# EAGLE design STorM32 RPiHat Extension v030 (EAGLE 7.5.0)
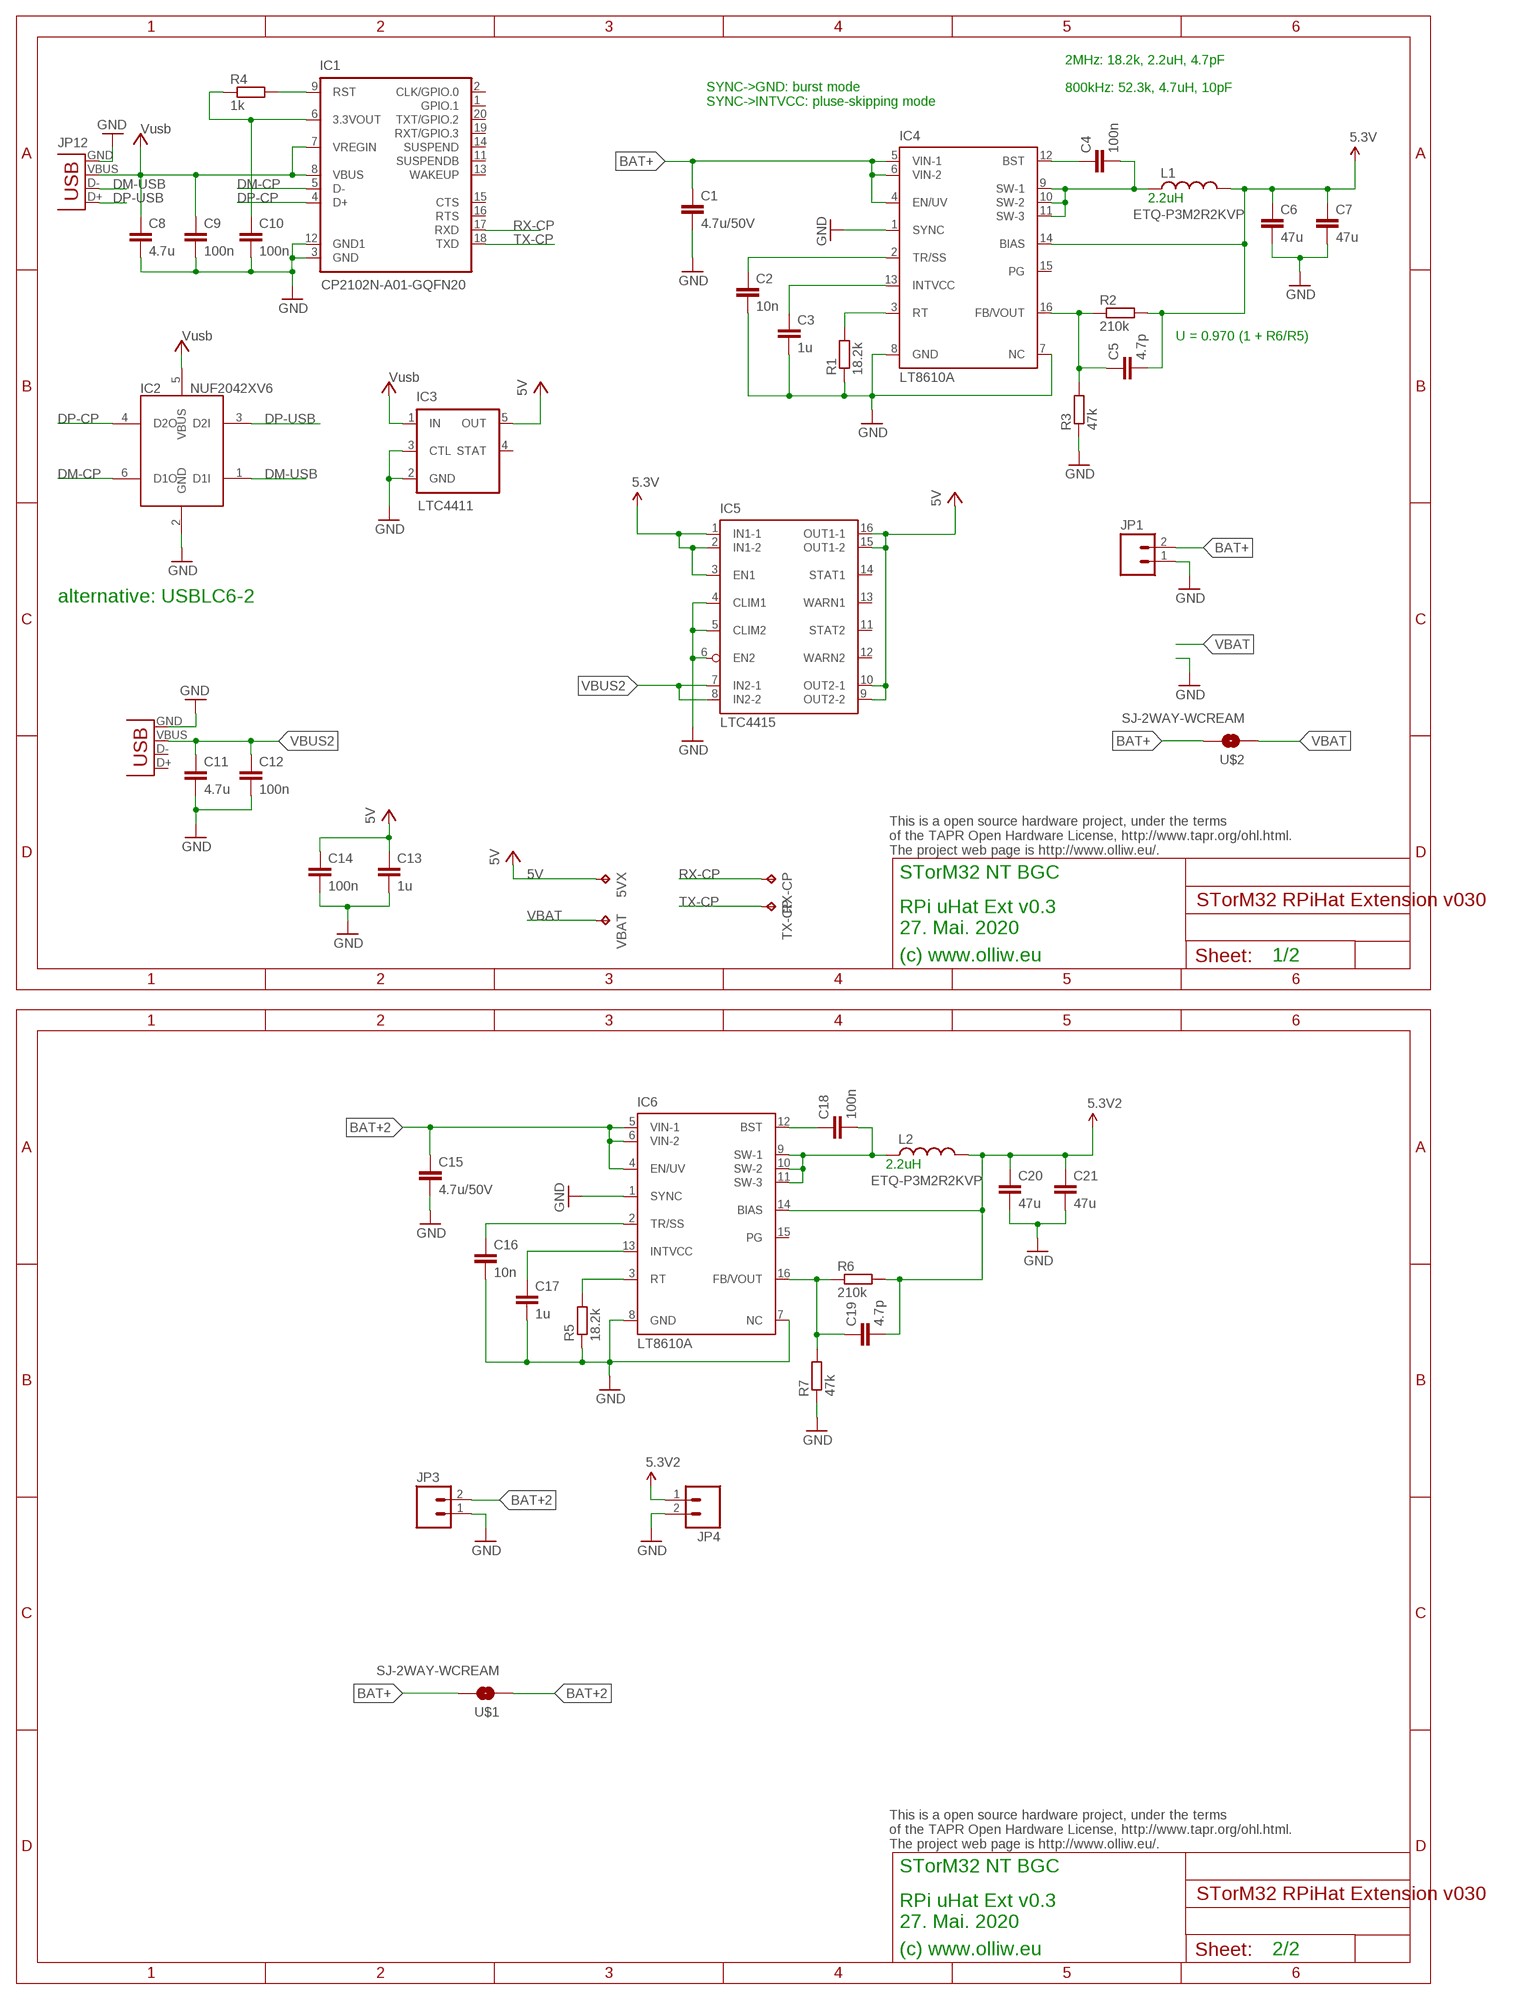
[diagram p0: schematic, sheet 1]

## Parts
5VX  TPB1,27  [B1,27]
C1  4.7u/50V  C-EUC1206  [C1206]
C2  10n  C-EUC0603K  [C0603K]
C3  1u  C-EUC0603K  [C0603K]
C4  100n  C-EUC0603K  [C0603K]
C5  4.7p  C-EUC0603K  [C0603K]
C6  47u  C-EUC1210  [C1210]
C7  47u  C-EUC1210  [C1210]
C8  4.7u  C-EUC0603  [C0603]
C9  100n  C-EUC0402  [C0402]
C10  100n  C-EUC0402  [C0402]
C11  4.7u  C-EUC0603  [C0603]
C12  100n  C-EUC0402  [C0402]
C13  1u  C-EUC0603  [C0603]
C14  100n  C-EUC0402  [C0402]
C15  4.7u/50V  C-EUC1206  [C1206]
C16  10n  C-EUC0603K  [C0603K]
C17  1u  C-EUC0603K  [C0603K]
C18  100n  C-EUC0603K  [C0603K]
C19  4.7p  C-EUC0603K  [C0603K]
C20  47u  C-EUC1210  [C1210]
C21  47u  C-EUC1210  [C1210]
IC1  CP2102N-A01-GQFN20  CP2102N-QFN20  [QFN20-CP2102N]
IC2  NUF2042XV6  [SOT563-6]
IC3  LTC4411  LTC411SOT23-5-SPARKFUN  [SOT23-5-SPARKFUN]
IC4  LT8610A  LT8610  [MSOP16]
IC5  LTC4415  [LTC4415]
IC6  LT8610A  LT8610  [MSOP16]
JP1  M021X02_NO_SILK  [1X02_NO_SILK]
JP3  M021X02_NO_SILK  [1X02_NO_SILK]
JP4  M021X02_NO_SILK  [1X02_NO_SILK]
L1  ETQ-P3M2R2KVP  LL5.4X5.4  [L5.4X5.4]
L2  ETQ-P3M2R2KVP  LL5.4X5.4  [L5.4X5.4]
R1  18.2k  R-EU_R0603  [R0603]
R2  210k  R-EU_R0603  [R0603]
R3  47k  R-EU_R0603  [R0603]
R4  1k  R-EU_R0402  [R0402]
R5  18.2k  R-EU_R0603  [R0603]
R6  210k  R-EU_R0603  [R0603]
R7  47k  R-EU_R0603  [R0603]
RX-CP  TPB1,27  [B1,27]
TX-CP  TPB1,27  [B1,27]
U$1  SJ-2WAY-WCREAM  [SJ-2WAY-BIG-WCREAM]
U$2  SJ-2WAY-WCREAM  [SJ-2WAY-BIG-WCREAM]
USB  Amphenol 10118192-0001LF  USB-MICROB  [USB-MICROB]
USB1  Amphenol 10118192-0001LF  USB-MICROB  [USB-MICROB]
VBAT  TPB1,27  [B1,27]

## Nets
3.3V-CP2102: C10.1 IC1.6(3.3VOUT) R4.1
5.3V: C5.2 C6.1 C7.1 IC4.14(BIAS) IC5.1(IN1-1) IC5.2(IN1-2) IC5.3(EN1) L1.2 R2.2
5.3V2: C19.2 C20.1 C21.1 IC6.14(BIAS) JP4.1 L2.2 R6.2
5V: 5VX.TP C13.1 C14.1 IC3.5(OUT) IC5.9(OUT2-2) IC5.10(OUT2-1) IC5.15(OUT1-2) IC5.16(OUT1-1)
BAT+: C1.1 IC4.4(EN/UV) IC4.5(VIN-1) IC4.6(VIN-2) JP1.2 U$1.2 U$2.2
BAT+2: C15.1 IC6.4(EN/UV) IC6.5(VIN-1) IC6.6(VIN-2) JP3.2 U$1.1
DM-CP: IC1.5(D-) IC2.6(D1O)
DM-USB: IC2.1(D1I) USB.D-
DP-CP: IC1.4(D+) IC2.4(D2O)
DP-USB: IC2.3(D2I) USB.D+
GND: C1.2 C2.2 C3.2 C6.2 C7.2 C8.2 C9.2 C10.2 C11.2 C12.2 C13.2 C14.2 C15.2 C16.2 C17.2 C20.2 C21.2 IC1.3(GND) IC1.12(GND1) IC2.2(GND) IC3.2(GND) IC3.3(CTL) IC4.1(SYNC) IC4.7(NC) IC4.8(GND) IC5.4(CLIM1) IC5.5(CLIM2) IC5.6(EN2) IC6.1(SYNC) IC6.7(NC) IC6.8(GND) JP1.1 JP3.1 JP4.2 R1.1 R3.1 R5.1 R7.1 USB1.GND USB.GND
N$3: C19.1 IC6.16(FB/VOUT) R6.1 R7.2
N$6: C17.1 IC6.13(INTVCC)
N$8: C4.1 IC4.12(BST)
N$9: C5.1 IC4.16(FB/VOUT) R2.1 R3.2
N$10: C18.1 IC6.12(BST)
N$11: IC4.3(RT) R1.2
N$12: C3.1 IC4.13(INTVCC)
N$16: IC6.3(RT) R5.2
N$17: C2.1 IC4.2(TR/SS)
N$18: IC1.9(RST) R4.2
N$19: C16.1 IC6.2(TR/SS)
RX-CP: IC1.17(RXD) RX-CP.TP
SW: C18.2 IC6.9(SW-1) IC6.10(SW-2) IC6.11(SW-3) L2.1
SW1: C4.2 IC4.9(SW-1) IC4.10(SW-2) IC4.11(SW-3) L1.1
TX-CP: IC1.18(TXD) TX-CP.TP
VBAT: U$2.1 VBAT.TP
VBUS2: C11.1 C12.1 IC5.7(IN2-1) IC5.8(IN2-2) USB1.VBUS
VUSB: C8.1 C9.1 IC1.7(VREGIN) IC1.8(VBUS) IC2.5(VBUS) IC3.1(IN) USB.VBUS ; supply symbol labelled Vusb
Unconnected: IC1.1(GPIO.1) IC1.2(CLK/GPIO.0) IC1.11(SUSPENDB) IC1.13(WAKEUP) IC1.14(SUSPEND) IC1.15(CTS) IC1.16(RTS) IC1.19(RXT/GPIO.3) IC1.20(TXT/GPIO.2) IC3.4(STAT) IC4.15(PG) IC5.11(STAT2) IC5.12(WARN2) IC5.13(WARN1) IC5.14(STAT1) IC6.15(PG) USB1.D+ USB1.D-

## Notes on the sheet
- 2MHz: 18.2k, 2.2uH, 4.7pF
- 800kHz: 52.3k, 4.7uH, 10pF
- SYNC->GND: burst mode
  SYNC->INTVCC: pluse-skipping mode
- JP12
- 2.2uH
- U = 0.970 (1 + R6/R5)
- alternative: USBLC6-2
- This is a open source hardware project, under the terms
  of the TAPR Open Hardware License, http://www.tapr.org/ohl.html.
  The project web page is http://www.olliw.eu/.
- STorM32 NT BGC
- RPi uHat Ext v0.3
  27. Mai. 2020
- (c) www.olliw.eu | 1/2
- 2.2uH
- This is a open source hardware project, under the terms
  of the TAPR Open Hardware License, http://www.tapr.org/ohl.html.
  The project web page is http://www.olliw.eu/.
- STorM32 NT BGC
- RPi uHat Ext v0.3
  27. Mai. 2020
- (c) www.olliw.eu | 2/2

## Library data of the parts
5VX RX-CP TX-CP VBAT = testpad:TP: Test pad
C1-C21 = rcl:C-EU: CAPACITOR, European symbol
IC1 = # stdlib:CP2102N-QFN20
IC2 = #z pixhawk2:NUF2042XV6
IC3 = # stdlib:LTC411
IC4 IC6 = # stdlib:LT8610
IC5 = # stdlib:LTC4415
JP1 JP3 JP4 = # SparkFun2:M02: Header 2 Standard 2-pin 0.1" header. Use with straight break away headers (SKU : PRT-00116), right angle break away headers (PRT-00553), swiss pins (PRT-00743), machine pins (PRT-00117), and female headers (PRT-00115). Molex polarized connector foot print use with SKU : PRT-08233 with associated crimp pins and housings.
L1 L2 = # stdlib:L
R1-R7 = rcl:R-EU_: RESISTOR, European symbol
U$1 U$2 = # stdlib:SJ-2WAY
USB USB1 = # SparkFun2:USB: USB Connectors USB-B-PTH is fully proven SKU : PRT-00139 USB-miniB is fully proven SKU : PRT-00587 USB-A-PCB is untested. USB-A-H is throughly reviewed, but untested. Spark Fun Electronics SKU : PRT-00437 USB-B-SMT is throughly reviewed, but untested. Needs silkscreen touching up. USB-A-S has not been used/tested USB-MB-H has not been used/tested

## Board
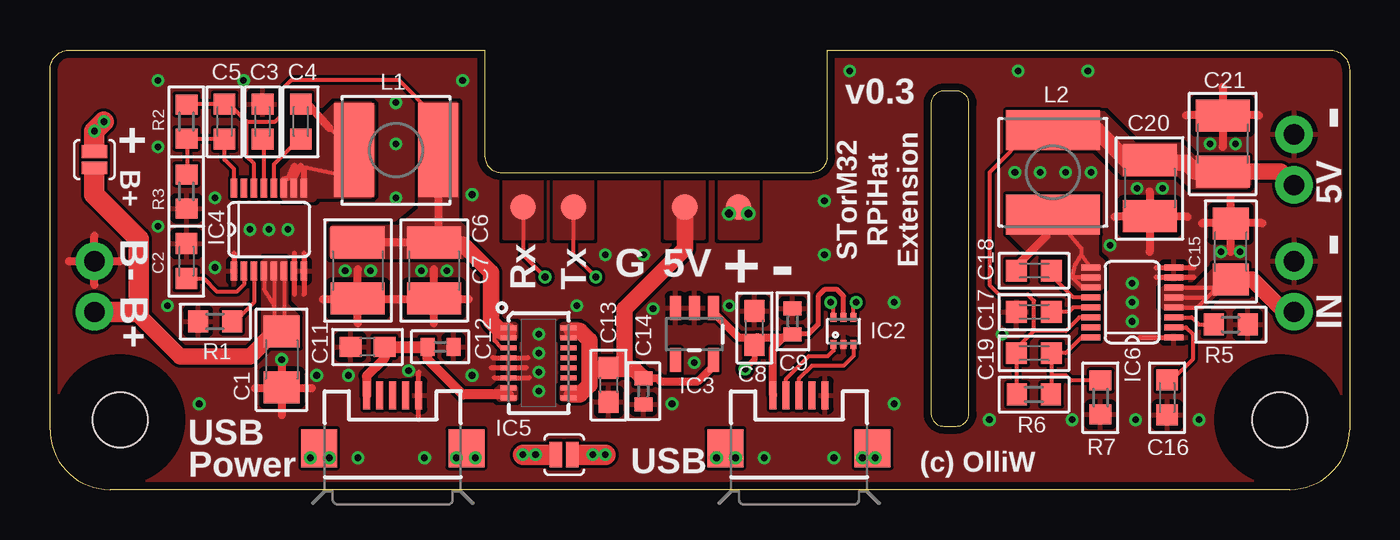
[diagram p1: board, top side]
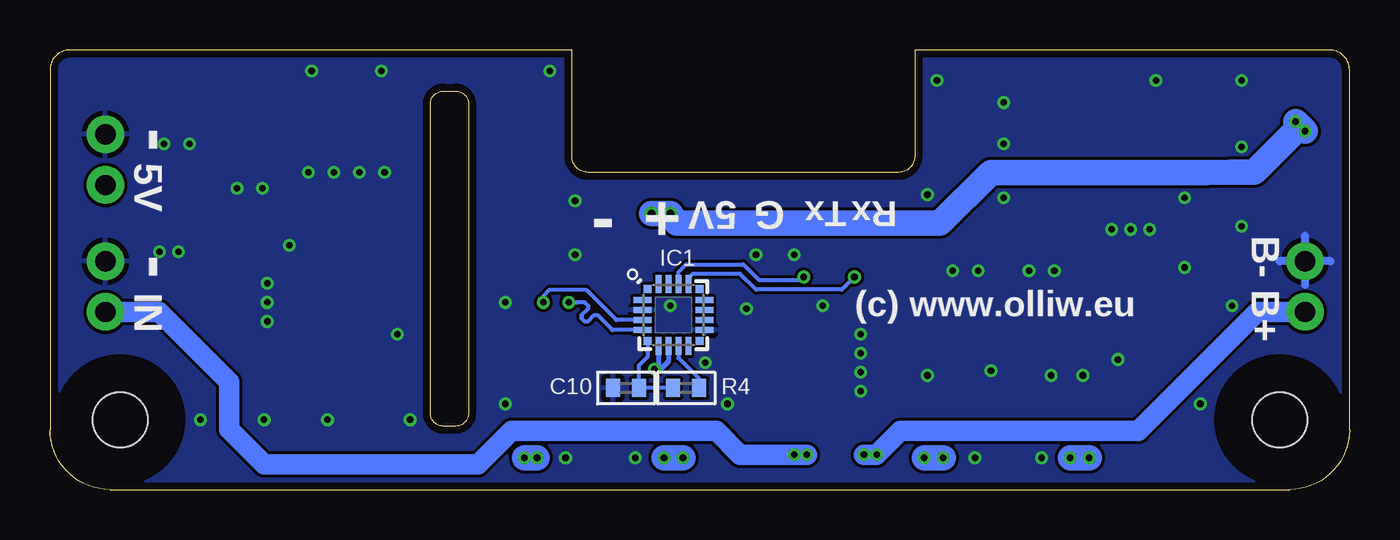
[diagram p2: board, bottom side, seen from below]

Size 65 x 22 mm. Coordinates in mm from the lower left corner, seen from the top.
Outline: 0,19.56 0,19.68
Outline: 1,22 21.75,22 21.75,16.67 arc90 22.54,15.88 38.1,15.88 arc90 38.89,16.67 38.89,22 64,22 arc-90 65,21 65,3 arc-90 62,0 3,0 arc-90 0,3 0,21 arc-90 1,22
Outline: 44.7,3.17 45.34,3.17 arc90 45.97,3.81 45.97,19.3 arc90 45.34,19.94 44.7,19.94 arc90 44.07,19.3 44.07,3.81 arc90 44.7,3.17
Copper layers (1*16): Top 0.035mm / dielectric 1.5mm / Bottom 0.035mm
Design rules "ShenZhen2U_2layer_EagleRules *": minimum track width 6mil, minimum drill 12mil, track to track 6mil, track to pad 6mil, pad to pad 6mil, via to via 6mil, smd to smd 0mil, copper to edge 15mil, drill to drill 10mil, minimum pad ring 10mil, minimum via ring 6mil, stop-mask expansion 2mil, vias tented up to drill 25mil, thermal gap 10mil
Holes 2.75 mm at 61.5,3.5 3.5,3.5
tRestrict: area 58.4,0.4 to 64.6,6.6; area 0.4,0.4 to 6.6,6.6
bRestrict: area 0.4,0.4 to 6.6,6.6; area 58.4,0.4 to 64.6,6.6

### Footprints (pad centres in the part's own frame; a part is rotated, then mirrored left to right if it is on the bottom)
B1,27 = smd 1.27 x 1.27: TP 0,0
C1206 = smd 1.6 x 1.8: 1 -1.4,0; 2 1.4,0
C0603K = smd 1.05 x 1.08: 1 -0.875,0; 2 0.875,0
C1210 = smd 1.6 x 2.7: 1 -1.4,0; 2 1.4,0
C0603 = smd 1.1 x 1: 1 -0.85,0; 2 0.85,0
C0402 = smd 0.7 x 0.9: 1 -0.65,0; 2 0.65,0
QFN20-CP2102N = smd 0.4 x 0.4: 1 -1.3,1.3; 6 -1.3,-1.3; 11 1.3,-1.3; 16 1.3,1.3 | smd 0.9 x 0.3: 2 -1.55,0.75; 3 -1.55,0.25; 4 -1.55,-0.25; 5 -1.55,-0.75; 12 1.55,-0.75; 13 1.55,-0.25; 14 1.55,0.25; 15 1.55,0.75 | smd 0.3 x 0.9: 7 -0.75,-1.55; 8 -0.25,-1.55; 9 0.25,-1.55; 10 0.75,-1.55; 17 0.75,1.55; 18 0.25,1.55; 19 -0.25,1.55; 20 -0.75,1.55
SOT563-6 = smd 0.3 x 0.45: 1 -0.5,-0.675; 2 0,-0.675; 3 0.5,-0.675; 4 0.5,0.675; 5 0,0.675; 6 -0.5,0.675
SOT23-5-SPARKFUN = smd 0.55 x 1.2: 1 -0.95,-1.3; 2 0,-1.3; 3 0.95,-1.3; 4 0.95,1.3; 5 -0.95,1.3
MSOP16 = smd 0.31 x 0.95: 1 -1.75,-2.075; 2 -1.25,-2.075; 3 -0.75,-2.075; 4 -0.25,-2.075; 5 0.25,-2.075; 6 0.75,-2.075; 7 1.25,-2.075; 8 1.75,-2.075; 9 1.75,2.075; 10 1.25,2.075; 11 0.75,2.075; 12 0.25,2.075; 13 -0.25,2.075; 14 -0.75,2.075; 15 -1.25,2.075; 16 -1.75,2.075
LTC4415 = smd 0.25 x 0.8: 1 -1.75,-1.5; 2 -1.25,-1.5; 3 -0.75,-1.5; 4 -0.25,-1.5; 5 0.25,-1.5; 6 0.75,-1.5; 7 1.25,-1.5; 8 1.75,-1.5; 9 1.75,1.5; 10 1.25,1.5; 11 0.75,1.5; 12 0.25,1.5; 13 -0.25,1.5; 14 -0.75,1.5; 15 -1.25,1.5; 16 -1.75,1.5
1X02_NO_SILK = drill 1.016 pad 1.88: 1 0,0; 2 2.54,0
L5.4X5.4 = smd 2 x 4.7: 1 -2.1,0; 2 2.1,0
R0603 = smd 1 x 1.1: 1 -0.85,0; 2 0.85,0
R0402 = smd 0.7 x 0.9: 1 -0.65,0; 2 0.65,0
SJ-2WAY-BIG-WCREAM = smd 0.635 x 1.27: 1 -0.4,0; 2 0.413,0
USB-MICROB = smd 0.35 x 1.4: D+ 0,2.65; D- -0.65,2.65; GND 1.3,2.65; ID 0.65,2.65; VBUS -1.3,2.65 | smd 1.8 x 1.9: MT1 -3.683,0; MT2 3.683,0

### Placement (x,y rotation side)
5VX  31.75,14.13 0 top
C1  11.59,6.51 270 top
C2  6.83,11.43 90 top
C3  10.64,18.41 90 top
C4  12.54,18.41 90 top
C5  8.73,18.41 90 top
C6  15.4,10.95 270 top
C7  19.21,10.95 270 top
C8  35.24,8.1 90 top
C9  37.15,8.41 90 top
C10  36.2,5.08 180 bottom
C11  15.88,7.14 180 top
C12  19.53,7.14 0 top
C13  27.94,5.24 270 top
C14  29.69,4.92 270 top
C15  59.05,11.91 90 top
C16  55.88,4.6 270 top
C17  49.21,8.89 180 top
C18  49.21,10.95 180 top
C19  49.21,6.83 180 top
C20  55.01,15.08 270 top
C21  58.66,17.3 90 top
IC1  33.81,8.73 0 bottom
IC2  39.69,7.94 0 top
IC3  32.23,7.78 180 top
IC4  10.95,13.02 0 top
IC5  24.45,6.35 270 top
IC6  54.13,9.37 90 top
JP1  2.22,11.43 270 top
JP3  62.23,11.43 270 top
JP4  62.23,15.24 90 top
L1  17.3,16.99 0 top
L2  50.16,15.88 90 top
R1  8.26,8.41 0 top
R2  6.83,18.41 90 top
R3  6.83,14.92 90 top
R4  33.18,5.08 0 bottom
R5  59.05,8.26 180 top
R6  49.21,4.76 180 top
R7  52.55,4.6 90 top
RX-CP  23.65,14.13 0 top
TX-CP  26.19,14.13 0 top
U$1  25.72,1.75 180 top
U$2  2.22,16.51 270 top
USB  37.47,2.06 0 top
USB1  17.14,2.06 0 top
VBAT  34.45,14.13 0 top

### Tracks (layer width: path | path; a pad name or v marks a point on that pad's centre or on a via)
3.3V-CP2102
  Bottom 0.203: R4.1 C10.1 35.56,4.94 35.56,6.19 35.11,6.64 IC1.6
5.3V
  Top 0.203: IC4.14 10.2,16.31 9.84,16.67 9.84,18.41 | R2.2 6.85,19.29 8.65,19.29 8.73,19.21 C5.2 8.97,19.29 9.84,18.41 | L1.2 19.25,18.7 17.46,20.48 12.06,20.48 11.59,20 11.59,18.73 11.27,18.41 9.84,18.41 | IC5.2 IC5.1 22.95,7.94 | IC5.3 22.59,7.1 22.23,7.46 22.23,7.94 22.38,8.1 22.54,7.94
  Top 0.406: L1.2 19.4,12.39 C7.1 C6.1
  Top 0.813: C7.1 20.67,12.27 22.07,10.87 22.07,8.41 22.54,7.94 22.95,7.94
  pour Top (no thermals): 14.05,13.1 14.13,13.18 17.46,13.18 18.49,14.05 18.49,19.29 18.57,19.37 20.32,19.37 20.4,19.29 20.4,13.49 20.72,13.18 20.72,11.67 20.64,11.59 14.13,11.59 14.05,11.67
  pour Top (no thermals): 22.23,7.58 22.23,8.33 23.26,8.33 23.34,8.26 23.34,7.58 23.26,7.5 22.3,7.5
5.3V2
  Top 0.203: IC6.14 51.48,8.62 50.8,7.94 49.21,7.94 | R6.2 48.34,4.79 C19.2 48.34,7.06 49.21,7.94 | 52.35,17.98 L2.2 49.09,17.98 46.99,15.88 46.99,10.24 47.47,9.76 48.9,9.76 49.21,9.45 49.21,7.94 | 55.27,16.35 C20.1
  Top 0.813: JP4.1 61.57,15.9 C21.1 57.28,15.9 56.83,16.35 55.27,16.35 | C20.1 54,16.32 52.35,17.98
  pour Top (no thermals): 49.37,18.89 52.7,18.89 54.29,17.3 56.59,17.3 57.39,16.51 59.69,16.51 60.01,16.19 60.01,15.24 59.85,15.08 57.07,15.08 56.44,15.72 53.66,15.72 52.23,17.14 49.85,17.14 49.37,17.62
5V
  Top 0.203: IC5.15 IC5.16 26.11,7.94 | IC5.9 IC5.10 26.11,4.76
  Top 0.406: IC3.5 33.18,6.19 32.38,5.4 30.56,5.4 30.4,5.56 29.7,5.56 C14.1
  Top 0.61: C14.1 29.59,5.65 | 28.04,6.03 C13.1 27.94,6.03 | 28.73,6.19 28.73,6.03
  Top 0.813: 26.11,7.94 26.51,7.94 26.99,7.46 26.99,6.03 | 26.11,4.76 26.51,4.76 26.99,5.24 26.99,6.03 | 5VX.TP 31.75,12.06 28.73,9.05 28.73,6.19 | 29.59,5.65 29.21,6.03 28.73,6.03 27.94,6.03 26.99,6.03
  pour Top (isolate 0.305, no thermals): 30.8,12.54 30.8,15.72 32.7,15.72 32.7,12.54
  pour Top (no thermals): 26.51,4.45 25.64,4.45 25.56,4.52 25.56,5.12 25.64,5.2 26.55,5.2 26.59,5.08 26.59,4.52
  pour Top (no thermals): 25.56,8.26 25.64,8.33 26.43,8.33 26.51,8.26 26.51,7.58 26.43,7.5 25.64,7.5 25.56,7.58
BAT+  (via drill 0.33)
  Top 0.152: 25.08,1.75 U$1.2
  Top 0.203: IC4.6 11.7,8.27 C1.1 | IC4.5 11.2,9.21 | 11.2,9.21 11.2,8.01 11.43,7.78 | IC4.4 10.7,10.03 11.2,9.21
  Top 0.406: 11.43,7.78 11.62,7.94 C1.1 | U$2.2 2.22,15.88
  Top 0.813: 11.43,7.78 11.11,7.78 10,6.67 6.51,6.67 4.45,8.73 4.45,8.89
  Top 1.016: JP1.2 4.45,8.89 4.45,12.54 2.22,14.76 2.22,15.88 | 25.08,1.75 v24.29,1.75 v23.65,1.75
  Bottom 1.016: v24.29,1.75 v23.65,1.75 22.46,2.94 10.56,2.94 4.6,8.89 JP1.2
  pour Top (no thermals): 10.64,7.62 10.64,11.43 10.79,11.59 11.67,11.59 11.83,11.43 11.83,9.29 12.38,8.73 12.38,7.62 12.22,7.46 10.79,7.46
BAT+2  (via drill 0.33)
  Top 0.152: 26.35,1.75 U$1.1
  Top 0.203: IC6.4 57.38,9.12 57.88,9.62 | IC6.5 57.88,9.62 | 57.88,9.62 58.42,10.16 58.71,10.16 C15.1 58.66,10.12 IC6.6
  Top 0.813: C15.1 60.14,10.51 61.75,8.89 JP3.2
  Top 1.016: 26.35,1.75 v27.78,1.75
  Bottom 1.016: v27.15,1.75 v27.78,1.75 30.48,1.75 31.67,2.94 41.91,2.94 43.58,1.27 54.29,1.27 56.04,3.02 56.04,5.4 59.53,8.89 JP3.2
  pour Top (no thermals): 59.05,9.84 58.42,9.84 57.63,9.05 55.72,9.05 55.56,9.21 55.56,10 55.72,10.16 57.31,10.16 58.26,11.11 59.53,11.11 59.53,10.32
DM-CP  (via drill 0.33)
  Top 0.203: IC2.6 39.19,9.23 v39.05,9.37
  Bottom 0.203: IC1.5 36.87,7.98 37.62,8.73 37.78,8.73 38.1,8.41 38.26,8.41 38.42,8.57 38.42,8.73 38.1,9.05 38.1,9.21 38.26,9.37 v39.05,9.37 38.58,9.37
DM-USB
  Top 0.203: IC2.1 39.19,6.96 38.89,6.67 37.94,6.67 36.81,5.54 USB.D-
DP-CP  (via drill 0.33)
  Top 0.203: IC2.4 40.19,9.23 v40.32,9.37
  Bottom 0.203: IC1.4 36.67,8.48 38.19,10 40.01,10 40.32,9.68 v40.32,9.37
DP-USB
  Top 0.203: IC2.3 40.19,6.69 39.69,6.19 38.1,6.19 37.47,5.56 USB.D+
GND  (via drill 0.33)
  Top 0.254: 12.22,11.83 12.22,9.76 | 12.7,11.83 12.7,9.76 | 9.21,11.83 9.21,10.72 | 22.15,6.59 23.89,6.59 | 22.07,6.11 23.81,6.11 | 22.23,5.6 23.97,5.6 | 18.45,3.5 18.45,5.88 | 55.32,10.64 57.23,10.64 | 55.32,11.11 57.23,11.11 | 54.53,7.62 56.44,7.62
  Top 0.406: 15.4,8.33 15.4,11.03 | 19.21,8.33 19.21,11.03 | 11.59,6.59 11.59,3.73 | 10.24,5.08 13.1,5.08 | 20.95,9.53 13.65,9.53 | 56.91,13.65 53.26,13.65 | 60.48,18.73 56.83,18.73 | 58.66,20.16 58.66,17.14 | 55.01,14.92 55.01,11.91 | 59.05,11.91 59.05,14.61 | 60.64,13.34 57.63,13.34 | 0.95,11.43 3.49,11.43 | 2.22,10.24 2.22,12.7
  Bottom 0.406: 2.22,10.24 2.22,12.7 | 0.95,11.43 3.49,11.43
  other vias: 10.95,13.02 11.91,13.02 10,13.02 24.45,6.83 24.45,7.78 24.45,5.87 24.45,4.92 33.97,9.21 15.4,1.59 18.73,1.59 35.72,1.59 30.16,9.05 17.3,17.3 17.3,19.37 17.3,14.61 11.59,6.51 13.34,5.71 14.76,10.95 16.03,10.95 18.57,10.95 19.84,10.95 8.26,14.61 8.26,11.11 5.87,9.21 54.13,9.37 54.13,10.32 54.13,8.41 49.53,15.88 50.8,15.88 48.26,15.88 52.07,15.88 54.37,15.08 55.64,15.08 58.02,17.3 59.29,17.3 58.58,11.91 59.53,11.91 54.29,3.49 57.47,3.49 51.12,3.49 47.62,7.78 9.68,20.48 39.21,1.59 27.78,11.75 29.69,11.75 38.73,11.75 38.73,14.45 26.35,9.21 42.23,9.37 42.23,4.29 48.42,20.95 51.91,20.95 46.99,3.49 53.02,12.22 21.11,14.76 20.64,20.48 31.11,4.29 40.01,20.95 14.92,5.71 21.11,5.71 5.4,20.48 5.4,17.14 5.4,13.18 7.46,4.29 17.94,5.95 32.23,6.35
  pour Top (isolate 0.152, rank 6): 0,0 0,22.27 65,22.27 65,0
  pour Bottom (isolate 0.152, rank 6): 0,0 0,22.27 65,22.27 65,0
N$3
  Top 0.203: 50.09,5.71 C19.1 50.8,6.83 51.59,7.62 IC6.16 | 50.09,5.71 50.09,4.79 R6.1 | 50.09,5.71 50.8,5.71 51.06,5.45 R7.2
N$5  (via drill 0.33)
  Bottom 1.27: v13.97,1.59 v13.02,1.59
N$6
  Top 0.203: IC6.13 51.19,9.12 50.96,8.89 C17.1
N$7  (via drill 0.33)
  Bottom 1.27: v33.34,1.59 v34.29,1.59
N$8
  Top 0.203: IC4.12 11.2,16.28 12.54,17.62 C4.1
N$9
  Top 0.203: 8.73,17.3 8.49,17.54 6.85,17.54 | 6.85,17.54 R2.1 | 6.85,17.54 6.85,15.64 R3.2 | IC4.16 9.2,16.04 8.73,16.51 8.73,17.3 | 8.73,17.3 C5.1
N$10
  Top 0.203: IC6.12 51.19,9.62 49.85,10.95 C18.1
N$11
  Top 0.203: IC4.3 10.2,9.35 9.26,8.41 R1.2
N$12
  Top 0.203: IC4.13 10.7,17.63 C3.1
N$13  (via drill 0.33)
  Bottom 1.27: v21.27,1.59 v20.32,1.59
N$14  (via drill 0.33)
  Bottom 1.27: v41.27,1.59 v40.64,1.59
N$16
  Top 0.203: IC6.3 57.11,8.62 57.47,8.26 R5.2
N$17
  Top 0.203: IC4.2 9.7,10.26 9.37,9.92 8.33,9.92 7.7,10.55 C2.1
N$18
  Bottom 0.203: IC1.9 33.56,6.58 32.54,5.56 32.54,4.94 R4.2
N$19
  Top 0.203: IC6.2 56.81,8.12 57.15,7.78 57.15,6.51 56.12,5.48 C16.1
RX-CP  (via drill 0.33)
  Top 0.203: RX-CP.TP 23.65,11.75 v24.77,10.64
  Bottom 0.203: v24.77,10.64 25.4,10 29.69,10 30.48,10.79 32.86,10.79 33.06,10.59 IC1.17
  pour Top (isolate 0.305, no thermals): 24.61,15.72 24.61,12.54 22.7,12.54 22.7,15.72
SW
  Top 0.203: IC6.11 51.64,10.12 51.14,10.62 | IC6.10 51.14,10.62 | 51.14,10.62 51.28,11.27 51.6,11.75 | IC6.9 51.6,11.75 | L2.1 51.59,12.07 51.6,11.75
  Top 0.406: C18.2 48.34,11.19 49.85,12.7 49.85,13.46 L2.1
  pour Top (no thermals): 47.94,14.61 52.39,14.61 52.39,11.75 52.7,11.43 52.7,10.16 52.55,10 51.44,10 51.04,10.4 51.04,11.59 50.72,11.91 48.9,11.91 47.94,12.86
SW1
  Top 0.203: C4.2 12.62,19.61 | 13.97,18.1 14.73,17.46 L1.1 15.24,17.02 15.24,17.62 14.92,17.3 14.92,15.88 14.76,15.72 12.54,16.19
  Top 0.305: IC4.11 11.7,15.51 11.99,15.64 | 11.99,15.64 12.22,16.19 | IC4.9 12.7,16.03 12.54,16.19 | 12.54,16.19 11.99,15.64 | IC4.10 12.2,15.54 12.54,16.19
  Top 0.406: 12.62,19.61 13.97,18.1
  pour Top (no thermals): 11.59,16.03 12.14,16.59 13.26,16.59 13.49,16.83 13.49,18.57 14.29,19.37 16.03,19.37 16.19,19.21 16.19,14.76 16.03,14.61 13.34,14.61 13.18,14.45 11.75,14.45 11.59,14.61
TX-CP  (via drill 0.33)
  Top 0.203: v27.3,10.64 26.19,11.75 TX-CP.TP
  Bottom 0.203: IC1.18 33.56,10.89 33.18,11.27 30.32,11.27 29.53,10.48 27.46,10.48 v27.3,10.64
  pour Top (isolate 0.305, no thermals): 25.24,12.54 25.24,15.72 27.15,15.72 27.15,12.54
VBAT  (via drill 0.33, 0.4)
  Top 0.203: v34.92,13.81 34.45,13.65 VBAT.TP
  Top 0.406: U$2.1 2.22,17.14
  Top 1.016: 2.22,17.14 v2.22,17.94 v2.7,18.41
  Bottom 1.27: v34.92,13.81 v33.97,13.81 33.66,13.34 20.48,13.34 17.94,15.88 7.14,15.88 5.93,15.89 4.75,15.89 2.46,18.18 | v2.7,18.41 2.46,18.18 | 2.46,18.18 v2.22,17.94
  pour Top (isolate 0.305, no thermals): 33.5,15.72 35.4,15.72 35.4,12.54 33.5,12.54
VBUS2
  Top 0.203: IC5.8 22.95,4.76 IC5.7
  Top 0.406: 18.89,6.97 C12.1
  Top 0.457: 15.85,5.68 USB1.VBUS
  Top 0.508: 22.95,4.76 20.64,4.76 18.89,6.51 18.89,6.97 | 15.85,5.68 16.73,6.57 C11.1
  Top 0.61: C11.1 C12.1
  pour Top (no thermals): 22.46,5.2 23.26,5.2 23.34,5.12 23.34,4.52 23.26,4.45 22.46,4.45 22.3,4.6 22.3,5.04
VUSB  (via drill 0.33)
  Top 0.203: 36.84,7.62 C9.1 | 35.34,7.62 35.03,7.35 35.04,7.34 34.99,7.34 C8.1
  Top 0.254: IC2.5 39.69,9.68 39.37,10 38.73,10 38.42,9.68 38.42,8.26 37.94,7.78 37.15,7.78 37.15,7.62 36.84,7.62
  Top 0.305: C8.1 35.24,6.51 v34.77,6.03
  Top 0.406: USB.VBUS 36.16,7.11 36.67,7.62 | 36.67,7.62 C9.1 36.97,7.62 36.84,7.62 36.67,7.62 | IC3.1 33.15,8.92 34.45,7.62 35.34,7.62 | C8.1 35.19,7.41 35.4,7.62 36.67,7.62
  Bottom 0.254: IC1.8 34.06,6.42 34.45,6.03 v34.77,6.03 34.56,6.24 IC1.7

### Text on the board
tNames: v0.3 | - | + | B+ | STorM32 / RPiHat / Extension | 5V | B- | - | - | + | G | 5V | B+ | Rx | Tx | IN | USB / Power | USB | (c) OlliW
bNames: - | 5V | + | - | Rx | Tx | G | 5V | B- | - | B+ | IN | (c) www.olliw.eu